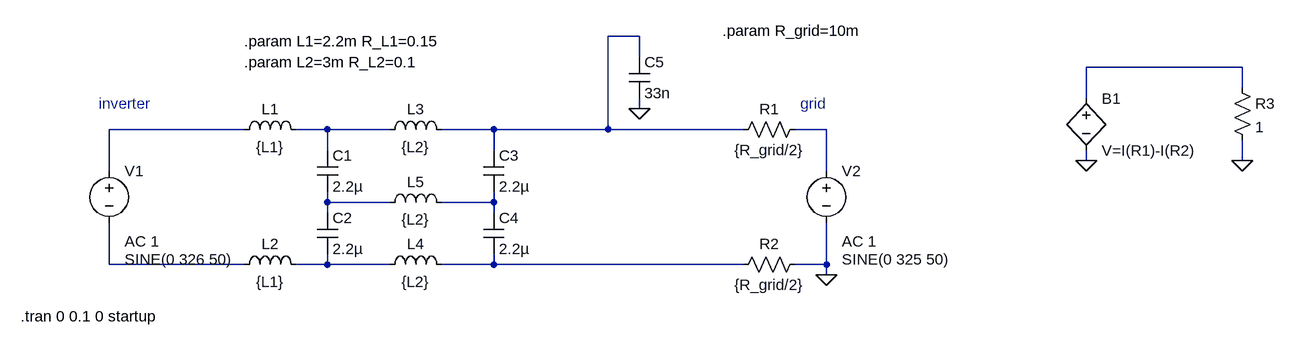
[diagram p0: schematic LCL-filter.asc]
LCL-filter.asc, the LTspice schematic file:
Version 4
SHEET 1 1720 680
WIRE 736 -64 688 -64
WIRE 736 -32 736 -64
WIRE 1664 -16 1424 -16
WIRE 1664 16 1664 -16
WIRE 1424 32 1424 -16
WIRE 736 48 736 32
WIRE 128 80 -80 80
WIRE 256 80 208 80
WIRE 352 80 256 80
WIRE 512 80 432 80
WIRE 688 80 688 -64
WIRE 688 80 512 80
WIRE 896 80 688 80
WIRE 1024 80 976 80
WIRE 256 112 256 80
WIRE 512 112 512 80
WIRE 1424 128 1424 112
WIRE 1664 128 1664 96
WIRE -80 144 -80 80
WIRE 1024 144 1024 80
WIRE 256 192 256 176
WIRE 352 192 256 192
WIRE 512 192 512 176
WIRE 512 192 432 192
WIRE 256 208 256 192
WIRE 512 208 512 192
WIRE -80 288 -80 224
WIRE 128 288 -80 288
WIRE 256 288 256 272
WIRE 256 288 208 288
WIRE 352 288 256 288
WIRE 512 288 512 272
WIRE 512 288 432 288
WIRE 896 288 512 288
WIRE 1024 288 1024 224
WIRE 1024 288 976 288
WIRE 1024 304 1024 288
FLAG 736 48 0
FLAG 1024 304 0
FLAG 1424 128 0
FLAG 1664 128 0
SYMBOL voltage -80 128 R0
WINDOW 3 24 152 Left 2
WINDOW 123 24 124 Left 2
WINDOW 39 0 0 Left 0
SYMATTR Value SINE(0 326 50)
SYMATTR Value2 AC 1
SYMATTR InstName V1
SYMBOL cap 240 112 R0
SYMATTR InstName C1
SYMATTR Value 2.2µ
SYMBOL ind 112 96 R270
WINDOW 0 32 56 VTop 2
WINDOW 3 5 56 VBottom 2
SYMATTR InstName L1
SYMATTR Value {L1}
SYMATTR SpiceLine Rser={R_L1}
SYMBOL cap 240 208 R0
SYMATTR InstName C2
SYMATTR Value 2.2µ
SYMBOL ind 112 304 R270
WINDOW 0 32 56 VTop 2
WINDOW 3 5 56 VBottom 2
SYMATTR InstName L2
SYMATTR Value {L1}
SYMATTR SpiceLine Rser={R_L1}
SYMBOL res 992 64 R90
WINDOW 0 0 56 VBottom 2
WINDOW 3 32 56 VTop 2
SYMATTR InstName R1
SYMATTR Value {R_grid/2}
SYMBOL cap 496 112 R0
SYMATTR InstName C3
SYMATTR Value 2.2µ
SYMBOL ind 336 96 R270
WINDOW 0 32 56 VTop 2
WINDOW 3 5 56 VBottom 2
SYMATTR InstName L3
SYMATTR Value {L2}
SYMATTR SpiceLine Rser={R_L2}
SYMBOL cap 496 208 R0
SYMATTR InstName C4
SYMATTR Value 2.2µ
SYMBOL ind 336 304 R270
WINDOW 0 32 56 VTop 2
WINDOW 3 5 56 VBottom 2
SYMATTR InstName L4
SYMATTR Value {L2}
SYMATTR SpiceLine Rser={R_L2}
SYMBOL ind 336 208 R270
WINDOW 0 32 56 VTop 2
WINDOW 3 5 56 VBottom 2
SYMATTR InstName L5
SYMATTR Value {L2}
SYMATTR SpiceLine Rser={R_L2}
SYMBOL cap 720 -32 R0
SYMATTR InstName C5
SYMATTR Value 33n
SYMBOL voltage 1024 128 R0
WINDOW 3 24 152 Left 2
WINDOW 123 24 124 Left 2
WINDOW 39 0 0 Left 0
SYMATTR Value SINE(0 325 50)
SYMATTR Value2 AC 1
SYMATTR InstName V2
SYMBOL res 880 304 R270
WINDOW 0 32 56 VTop 2
WINDOW 3 0 56 VBottom 2
SYMATTR InstName R2
SYMATTR Value {R_grid/2}
SYMBOL bv 1424 16 R0
SYMATTR InstName B1
SYMATTR Value V=I(R1)-I(R2)
SYMBOL res 1648 0 R0
SYMATTR InstName R3
SYMATTR Value 1
TEXT 128 -56 Left 2 !.param L1=2.2m R_L1=0.15
TEXT -216 368 Left 2 !.tran 0 0.1 0 startup
TEXT -96 40 Left 2 ;inverter
TEXT 984 40 Left 2 ;grid
TEXT 864 -72 Left 2 !.param R_grid=10m
TEXT 128 -24 Left 2 !.param L2=3m R_L2=0.1

The netlist it stands for:
* LCL-filter.asc
V1 N003 N008 SINE(0 326 50) AC 1
C1 N004 N006 2.2µ
L1 N003 N004 {L1} Rser={R_L1}
C2 N006 N009 2.2µ
L2 N008 N009 {L1} Rser={R_L1}
R1 N005 N001 {R_grid/2}
C3 N001 N007 2.2µ
L3 N004 N001 {L2} Rser={R_L2}
C4 N007 N010 2.2µ
L4 N009 N010 {L2} Rser={R_L2}
L5 N006 N007 {L2} Rser={R_L2}
C5 N001 0 33n
V2 N005 0 SINE(0 325 50) AC 1
R2 N010 0 {R_grid/2}
B1 N002 0 V=I(R1)-I(R2)
R3 N002 0 1
.param L1=2.2m R_L1=0.15
.tran 0 0.1 0 startup
* inverter
* grid
.param R_grid=10m
.param L2=3m R_L2=0.1
.backanno
.end